# Altium schematic sheet TOP.SchDoc: Fast Stabilizer
size 420 x 297 mm; CheckedBy: G.Kasprowicz; Author: P. Zdunek; DrawnBy: P. Zdunek; Organization: Altium Limited; DocumentNumber: 1; SheetNumber: 1; SheetTotal: 37; Designer: P. Zdunek; ModifiedBy: -; CheckedDate: -; Title2: Title 2; DivGrp: WUT ISE
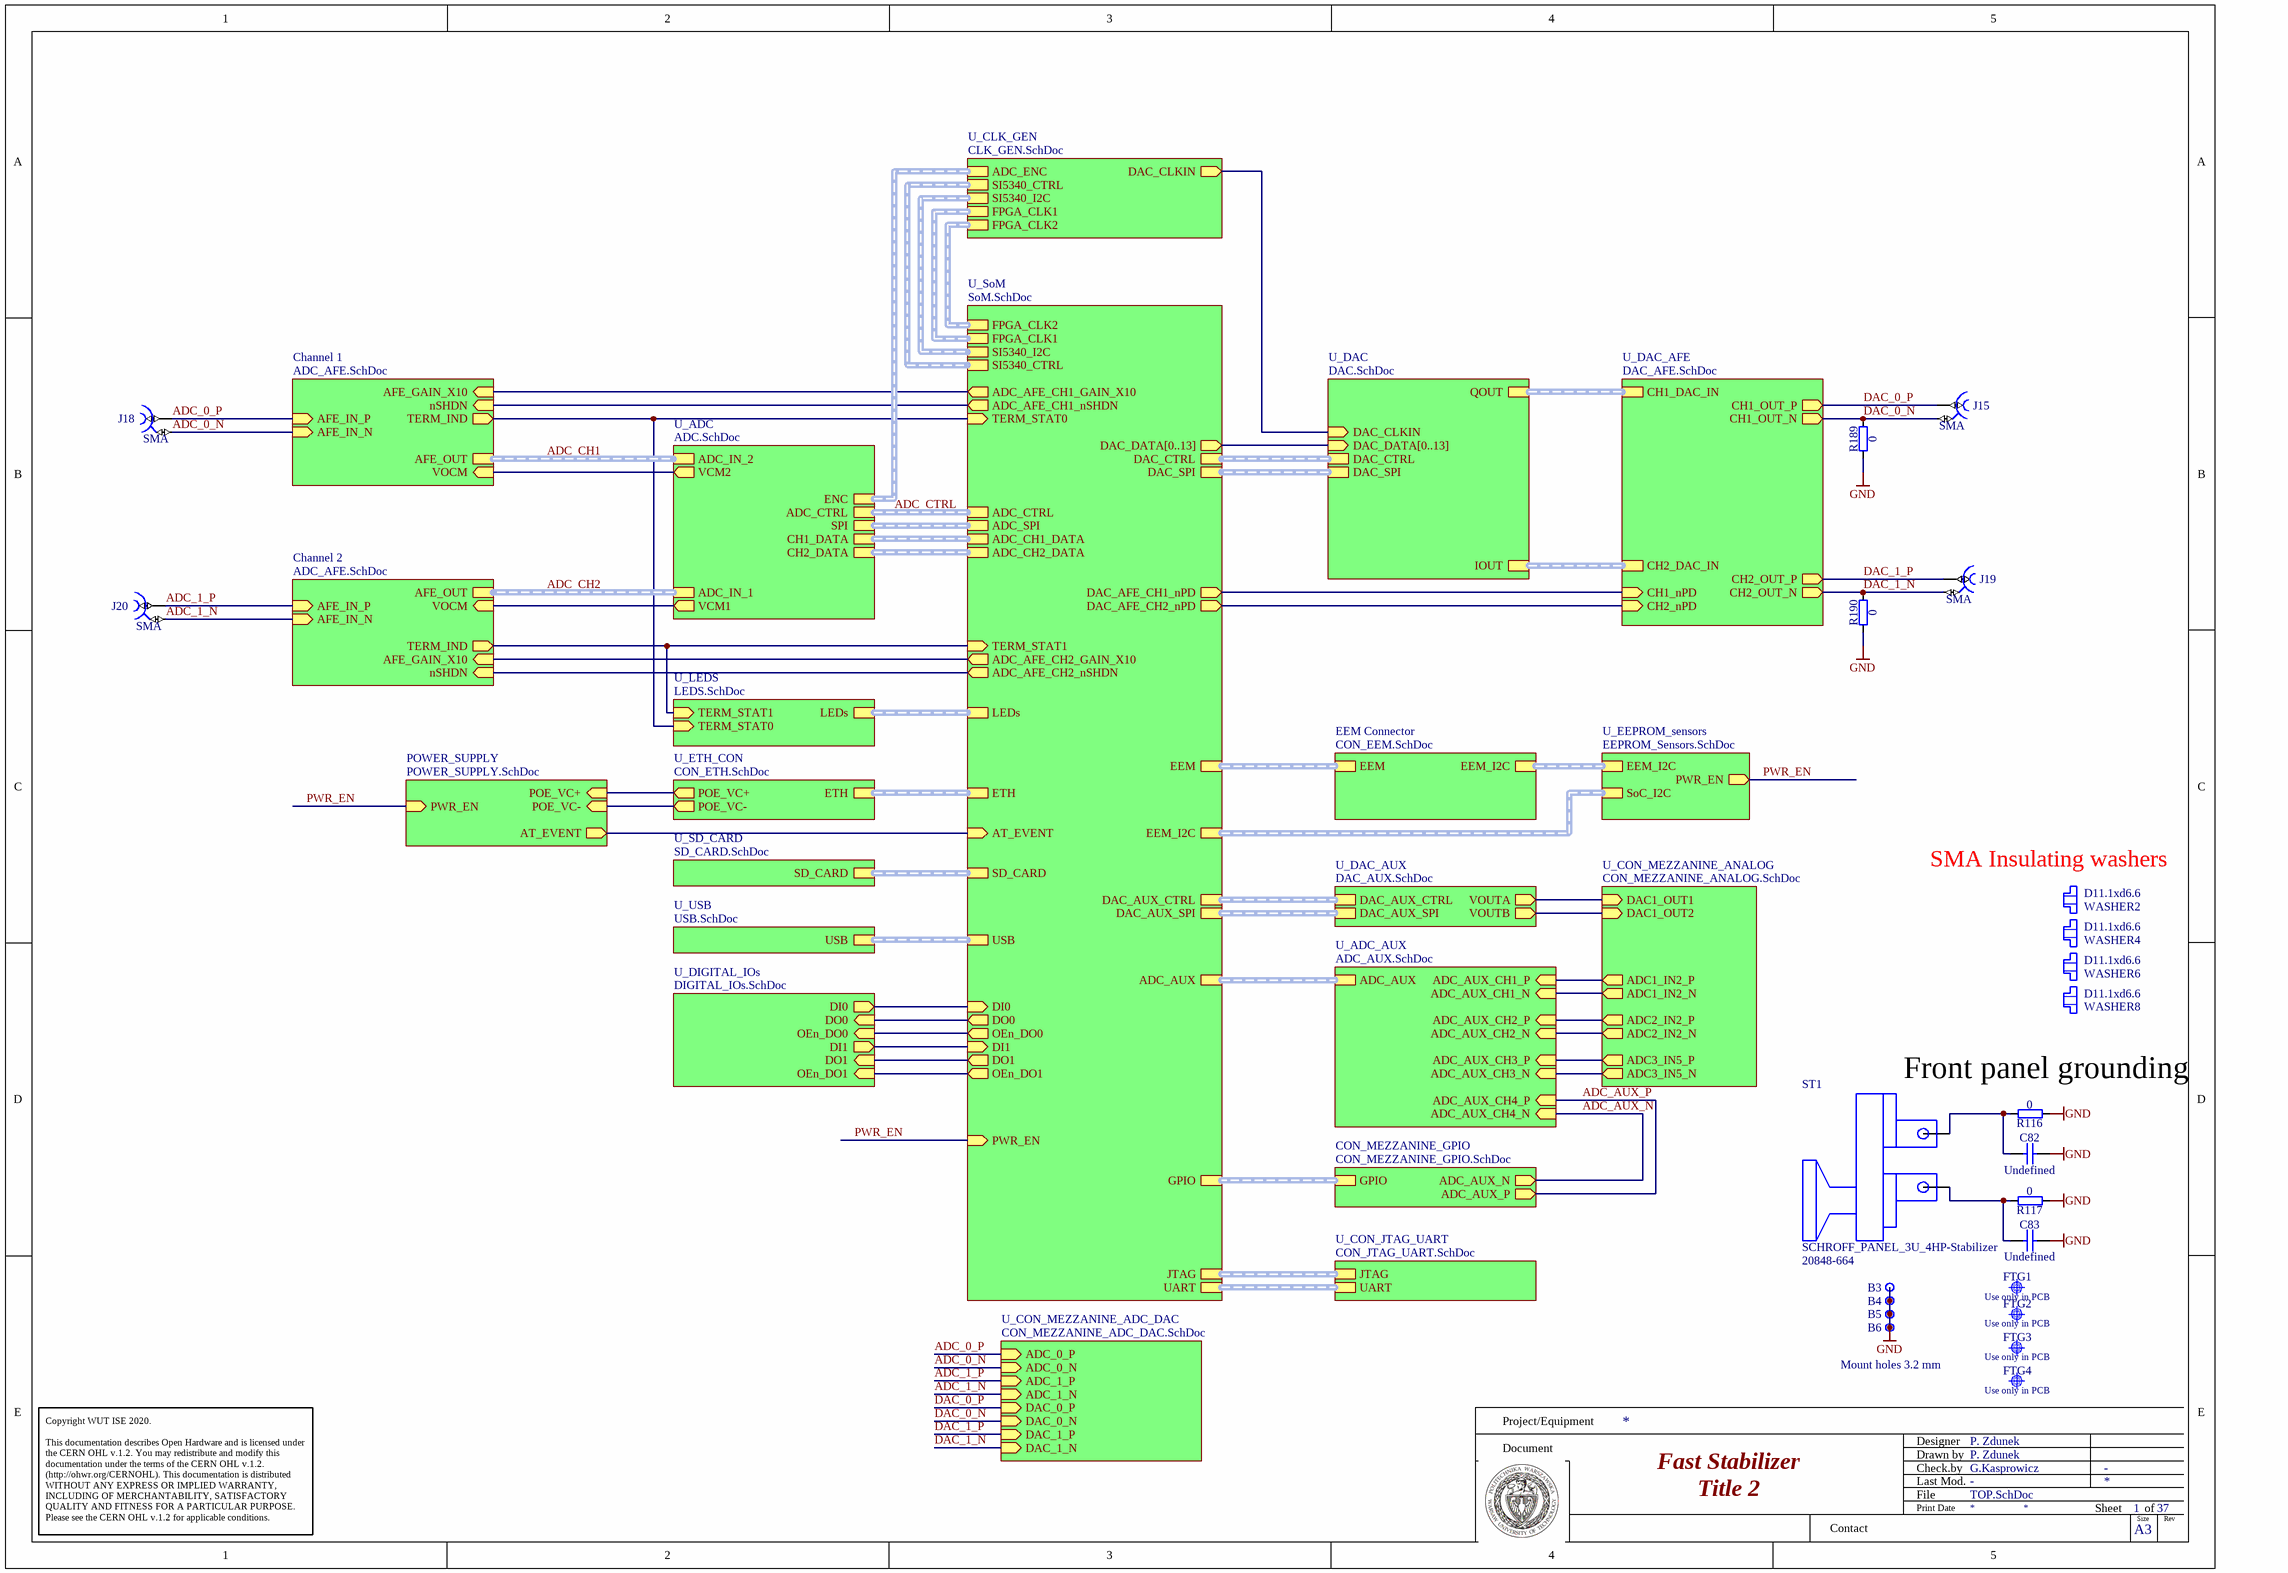
[diagram p0: TOP.SchDoc]

## Parts
B3  Plated Hole  [MTG320_550]  (value not drawn)  (no BOM)
B4  Plated Hole  [MTG320_550]  (value not drawn)  (no BOM)
B5  Plated Hole  [MTG320_550]  (value not drawn)  (no BOM)
B6  Plated Hole  [MTG320_550]  (value not drawn)  (no BOM)
C82  Undefined  [CAPC1608X90N]
C83  Undefined  [CAPC1608X90N]
FTG1  Use only in PCB  [FIDUCIAL_TOP_C100-200]  (no BOM)
FTG2  Use only in PCB  [FIDUCIAL_TOP_S100-200]  (no BOM)
FTG3  Use only in PCB  [FIDUCIAL_TOP_S100-200]  (no BOM)
FTG4  Use only in PCB  [FIDUCIAL_TOP_S100-200]  (no BOM)
J15  SMA  [DELOCK_65848]
J18  SMA  [DELOCK_65848]
J19  SMA  [DELOCK_65848]
J20  SMA  [DELOCK_65848]
R116  0  [RESC1005X40N]
R117  0  [RESC1005X40N]
R189  0  [RESC1005X40N]
R190  0  [RESC1005X40N]
ST1  SCHROFF_PANEL_3U_4HP-Stabilizer  Manufacturer Part Number 2: 20848-664  [SCHROFF_PANEL_3HP_4U - Stabilizer]
WASHER2  D11.1xd6.6  [Keystone_7687]
WASHER4  D11.1xd6.6  [Keystone_7687]
WASHER6  D11.1xd6.6  [Keystone_7687]
WASHER8  D11.1xd6.6  [Keystone_7687]

## Sub-sheets
Channel 1 = ADC_AFE.SchDoc: AFE_OUT (harness DIFF_SIGNAL), VOCM (in), AFE_IN_P (in), AFE_IN_N (in), nSHDN (in), AFE_GAIN_X10 (in), TERM_IND (out)
Channel 2 = ADC_AFE.SchDoc: AFE_OUT (harness DIFF_SIGNAL), VOCM (in), AFE_IN_P (in), AFE_IN_N (in), nSHDN (in), AFE_GAIN_X10 (in), TERM_IND (out)
CON_MEZZANINE_GPIO = CON_MEZZANINE_GPIO.SchDoc: GPIO (harness GPIO), ADC_AUX_P (out), ADC_AUX_N (out)
EEM Connector = CON_EEM.SchDoc: EEM (harness EEM), EEM_I2C (harness EEM_I2C)
POWER_SUPPLY = POWER_SUPPLY.SchDoc: POE_VC+ (in), POE_VC- (in), AT_EVENT (out), PWR_EN (in)
U_ADC = ADC.SchDoc: ADC_IN_1 (harness DIFF_SIGNAL), VCM1 (out), VCM2 (out), ADC_IN_2 (harness DIFF_SIGNAL), CH1_DATA (harness LTC2195_DATA), CH2_DATA (harness LTC2195_DATA), SPI (harness LTC2195_SPI), ENC (harness DIFFCLK), ADC_CTRL (harness LTC2195_CTRL)
U_ADC_AUX = ADC_AUX.SchDoc: ADC_AUX_CH3_P (in), ADC_AUX_CH3_N (in), ADC_AUX_CH2_P (in), ADC_AUX_CH2_N (in), ADC_AUX_CH1_P (in), ADC_AUX_CH1_N (in), ADC_AUX (harness ADC_AUX), ADC_AUX_CH4_N (in), ADC_AUX_CH4_P (in)
U_CLK_GEN = CLK_GEN.SchDoc: SI5340_CTRL (harness SI5340_CTRL), SI5340_I2C (harness I2C), FPGA_CLK1 (harness DIFFCLK), FPGA_CLK2 (harness DIFFCLK), DAC_CLKIN (out), ADC_ENC (harness DIFFCLK)
U_CON_JTAG_UART = CON_JTAG_UART.SchDoc: JTAG (harness JTAG), UART (harness UART)
U_CON_MEZZANINE_ADC_DAC = CON_MEZZANINE_ADC_DAC.SchDoc: ADC_0_P (in), ADC_0_N (in), ADC_1_P (in), ADC_1_N (in), DAC_0_P (in), DAC_0_N (in), DAC_1_P (in), DAC_1_N (in)
U_CON_MEZZANINE_ANALOG = CON_MEZZANINE_ANALOG.SchDoc: ADC1_IN2_P (out), ADC1_IN2_N (out), ADC2_IN2_N (out), ADC2_IN2_P (out), ADC3_IN5_P (out), ADC3_IN5_N (out), DAC1_OUT1 (in), DAC1_OUT2 (in)
U_DAC = DAC.SchDoc: QOUT (harness DIFF_SIGNAL), IOUT (harness DIFF_SIGNAL), DAC_DATA[0..13] (in), DAC_CTRL (harness AD9117_DAC_CTRL), DAC_SPI (harness AD9117_DAC_SPI), DAC_CLKIN (in)
U_DAC_AFE = DAC_AFE.SchDoc: CH1_nPD (in), CH1_OUT_P (out), CH1_DAC_IN (harness DIFF_SIGNAL), CH2_DAC_IN (harness DIFF_SIGNAL), CH2_OUT_P (out), CH2_nPD (in), CH1_OUT_N (out), CH2_OUT_N (out)
U_DAC_AUX = DAC_AUX.SchDoc: VOUTA (out), VOUTB (out), DAC_AUX_CTRL (harness DAC_AUX_CTRL), DAC_AUX_SPI (harness DAC_AUX_SPI)
U_DIGITAL_IOs = DIGITAL_IOs.SchDoc: DI1 (out), DI0 (out), OEn_DO0 (in), DO0 (in), OEn_DO1 (in), DO1 (in)
U_EEPROM_sensors = EEPROM_Sensors.SchDoc: EEM_I2C (harness EEM_I2C), SoC_I2C (harness EEM_I2C), PWR_EN (out)
U_ETH_CON = CON_ETH.SchDoc: ETH (harness ETH), POE_VC+ (out), POE_VC- (out)
U_LEDS = LEDS.SchDoc: LEDs (harness LEDs), TERM_STAT1 (in), TERM_STAT0 (in)
U_SD_CARD = SD_CARD.SchDoc: SD_CARD (harness SD_CARD)
U_SoM = SoM.SchDoc: EEM (harness EEM), EEM_I2C (harness EEM_I2C), TERM_STAT1 (in), ADC_AFE_CH2_GAIN_X10 (out), ADC_AFE_CH1_GAIN_X10 (out), TERM_STAT0 (in), LEDs (harness LEDs), ADC_AUX (harness ADC_AUX), DAC_AUX_CTRL (harness DAC_AUX_CTRL), DAC_AUX_SPI (harness DAC_AUX_SPI), DAC_DATA[0..13] (out), DAC_CTRL (harness AD9117_DAC_CTRL), DAC_AFE_CH1_nPD (out), FPGA_CLK2 (harness DIFFCLK), JTAG (harness JTAG), UART (harness UART), GPIO (harness GPIO), SI5340_CTRL (harness SI5340_CTRL), ADC_AFE_CH2_nSHDN (out), ADC_AFE_CH1_nSHDN (out), FPGA_CLK1 (harness DIFFCLK), SI5340_I2C (harness I2C), DAC_SPI (harness AD9117_DAC_SPI), ADC_CH2_DATA (harness LTC2195_DATA), ADC_CH1_DATA (harness LTC2195_DATA), ADC_SPI (harness LTC2195_SPI), ADC_CTRL (harness LTC2195_CTRL), DAC_AFE_CH2_nPD (out), ETH (harness ETH), SD_CARD (harness SD_CARD), USB (harness USB), DI0 (in), DI1 (in), AT_EVENT (in), DO0 (out), OEn_DO0 (out), DO1 (out), OEn_DO1 (out), PWR_EN (in)
U_USB = USB.SchDoc: USB (harness USB)

## Nets
GND: B3.1 B4.1 B5.1 B6.1 C82.2 C83.2 R116.1 R117.1 R189.1 R190.1
ADC_0_N: J18.2 ; sheet Channel 1/AFE_IN_N, sheet U_CON_MEZZANINE_ADC_DAC/ADC_0_N
ADC_0_P: J18.1 ; sheet Channel 1/AFE_IN_P, sheet U_CON_MEZZANINE_ADC_DAC/ADC_0_P
ADC_1_N: J20.2 ; sheet Channel 2/AFE_IN_N, sheet U_CON_MEZZANINE_ADC_DAC/ADC_1_N
ADC_1_P: J20.1 ; sheet Channel 2/AFE_IN_P, sheet U_CON_MEZZANINE_ADC_DAC/ADC_1_P
ADC_AUX_N: sheet CON_MEZZANINE_GPIO/ADC_AUX_N, sheet U_ADC_AUX/ADC_AUX_CH4_N
ADC_AUX_P: sheet CON_MEZZANINE_GPIO/ADC_AUX_P, sheet U_ADC_AUX/ADC_AUX_CH4_P
DAC_0_N: J15.2 R189.2 ; sheet U_DAC_AFE/CH1_OUT_N, sheet U_CON_MEZZANINE_ADC_DAC/DAC_0_N
DAC_0_P: J15.1 ; sheet U_DAC_AFE/CH1_OUT_P, sheet U_CON_MEZZANINE_ADC_DAC/DAC_0_P
DAC_1_N: J19.2 R190.2 ; sheet U_DAC_AFE/CH2_OUT_N, sheet U_CON_MEZZANINE_ADC_DAC/DAC_1_N
DAC_1_P: J19.1 ; sheet U_DAC_AFE/CH2_OUT_P, sheet U_CON_MEZZANINE_ADC_DAC/DAC_1_P
PWR_EN: sheet U_SoM/PWR_EN, sheet U_EEPROM_sensors/PWR_EN, sheet POWER_SUPPLY/PWR_EN
NetC82_1: C82.1 R116.2 ST1.1
NetC83_1: C83.1 R117.2 ST1.0
(unnamed): sheet U_SoM/TERM_STAT1, sheet U_LEDS/TERM_STAT1, sheet Channel 2/TERM_IND
(unnamed): sheet U_SoM/ADC_AFE_CH2_GAIN_X10, sheet Channel 2/AFE_GAIN_X10
(unnamed): sheet U_SoM/ADC_AFE_CH1_GAIN_X10, sheet Channel 1/AFE_GAIN_X10
(unnamed): sheet U_SoM/TERM_STAT0, sheet U_LEDS/TERM_STAT0, sheet Channel 1/TERM_IND
(unnamed): sheet U_SoM/DAC_AFE_CH1_nPD, sheet U_DAC_AFE/CH1_nPD
(unnamed): sheet U_SoM/ADC_AFE_CH2_nSHDN, sheet Channel 2/nSHDN
(unnamed): sheet U_SoM/ADC_AFE_CH1_nSHDN, sheet Channel 1/nSHDN
(unnamed): sheet U_SoM/DAC_AFE_CH2_nPD, sheet U_DAC_AFE/CH2_nPD
(unnamed): sheet U_SoM/DI0, sheet U_DIGITAL_IOs/DI0
(unnamed): sheet U_SoM/DI1, sheet U_DIGITAL_IOs/DI1
(unnamed): sheet U_SoM/AT_EVENT, sheet POWER_SUPPLY/AT_EVENT
(unnamed): sheet U_SoM/DO0, sheet U_DIGITAL_IOs/DO0
(unnamed): sheet U_SoM/OEn_DO0, sheet U_DIGITAL_IOs/OEn_DO0
(unnamed): sheet U_SoM/DO1, sheet U_DIGITAL_IOs/DO1
(unnamed): sheet U_SoM/OEn_DO1, sheet U_DIGITAL_IOs/OEn_DO1
(unnamed): sheet U_ADC/VCM1, sheet Channel 2/VOCM
(unnamed): sheet U_ADC/VCM2, sheet Channel 1/VOCM
(unnamed): sheet U_DAC/DAC_CLKIN, sheet U_CLK_GEN/DAC_CLKIN
(unnamed): sheet U_DAC_AUX/VOUTA, sheet U_CON_MEZZANINE_ANALOG/DAC1_OUT1
(unnamed): sheet U_DAC_AUX/VOUTB, sheet U_CON_MEZZANINE_ANALOG/DAC1_OUT2
(unnamed): sheet U_CON_MEZZANINE_ANALOG/ADC1_IN2_P, sheet U_ADC_AUX/ADC_AUX_CH1_P
(unnamed): sheet U_CON_MEZZANINE_ANALOG/ADC1_IN2_N, sheet U_ADC_AUX/ADC_AUX_CH1_N
(unnamed): sheet U_CON_MEZZANINE_ANALOG/ADC2_IN2_N, sheet U_ADC_AUX/ADC_AUX_CH2_N
(unnamed): sheet U_CON_MEZZANINE_ANALOG/ADC2_IN2_P, sheet U_ADC_AUX/ADC_AUX_CH2_P
(unnamed): sheet U_CON_MEZZANINE_ANALOG/ADC3_IN5_P, sheet U_ADC_AUX/ADC_AUX_CH3_P
(unnamed): sheet U_CON_MEZZANINE_ANALOG/ADC3_IN5_N, sheet U_ADC_AUX/ADC_AUX_CH3_N
(unnamed): sheet U_ETH_CON/POE_VC+, sheet POWER_SUPPLY/POE_VC+
(unnamed): sheet U_ETH_CON/POE_VC-, sheet POWER_SUPPLY/POE_VC-

## Buses and harness runs
bus sheet U_DAC/DAC_DATA[0..13] = sheet U_SoM/DAC_DATA[0..13]
harness ADC_CH1 = sheet Channel 1/AFE_OUT = sheet U_ADC/ADC_IN_2
harness ADC_CH2 = sheet Channel 2/AFE_OUT = sheet U_ADC/ADC_IN_1
harness ADC_CTRL = sheet U_ADC/ADC_CTRL = sheet U_SoM/ADC_CTRL
harness sheet CON_MEZZANINE_GPIO/GPIO = sheet U_SoM/GPIO
harness sheet EEM Connector/EEM = sheet U_SoM/EEM
harness sheet EEM Connector/EEM_I2C = sheet U_EEPROM_sensors/EEM_I2C
harness sheet U_ADC/CH1_DATA = sheet U_SoM/ADC_CH1_DATA
harness sheet U_ADC/CH2_DATA = sheet U_SoM/ADC_CH2_DATA
harness sheet U_ADC/ENC = sheet U_CLK_GEN/ADC_ENC
harness sheet U_ADC/SPI = sheet U_SoM/ADC_SPI
harness sheet U_ADC_AUX/ADC_AUX = sheet U_SoM/ADC_AUX
harness sheet U_CLK_GEN/FPGA_CLK1 = sheet U_SoM/FPGA_CLK1
harness sheet U_CLK_GEN/FPGA_CLK2 = sheet U_SoM/FPGA_CLK2
harness sheet U_CLK_GEN/SI5340_CTRL = sheet U_SoM/SI5340_CTRL
harness sheet U_CLK_GEN/SI5340_I2C = sheet U_SoM/SI5340_I2C
harness sheet U_CON_JTAG_UART/JTAG = sheet U_SoM/JTAG
harness sheet U_CON_JTAG_UART/UART = sheet U_SoM/UART
harness sheet U_DAC/DAC_CTRL = sheet U_SoM/DAC_CTRL
harness sheet U_DAC/DAC_SPI = sheet U_SoM/DAC_SPI
harness sheet U_DAC/IOUT = sheet U_DAC_AFE/CH2_DAC_IN
harness sheet U_DAC/QOUT = sheet U_DAC_AFE/CH1_DAC_IN
harness sheet U_DAC_AUX/DAC_AUX_CTRL = sheet U_SoM/DAC_AUX_CTRL
harness sheet U_DAC_AUX/DAC_AUX_SPI = sheet U_SoM/DAC_AUX_SPI
harness sheet U_EEPROM_sensors/SoC_I2C = sheet U_SoM/EEM_I2C
harness sheet U_ETH_CON/ETH = sheet U_SoM/ETH
harness sheet U_LEDS/LEDs = sheet U_SoM/LEDs
harness sheet U_SD_CARD/SD_CARD = sheet U_SoM/SD_CARD
harness sheet U_SoM/USB = sheet U_USB/USB

## Notes on the sheet
- (near WASHER2) SMA Insulating washers
- (near R116) Front panel grounding
- Mount holes 3.2 mm
- Project/Equipment
- Document
- Designer
- Drawn by
- Check.by
- Copyright WUT ISE 2020.
  This documentation describes Open Hardware and is licensed under the CERN OHL v.1.2. You may redistribute and modify this documentation under the terms of the CERN OHL v.1.2. (http://ohwr.org/CERNOHL). This documentation is distributed WITHOUT ANY EXPRESS OR IMPLIED WARRANTY, INCLUDING OF MERCHANTABILITY, SATISFACTORY QUALITY AND FITNESS FOR A PARTICULAR PURPOSE. Please see the CERN OHL v.1.2 for applicable conditions.
- Contact
- File
- Last Mod.
- Print Date
- Sheet
- Size
- A3
- of
- Rev

## Library data of the parts
B3-B6 = PLATED_HOLE3.2_PAD5.5: Single Terminal Socket; Part Description: Plated Through Hole: Hole Dia.=3.2mm Pad Dia.=5.5mm; Mounted: No; Part Number: PLATED_HOLE3.2_PAD5.5; Component Type: Standard (No BOM); Pin Count: 1; Family: Plated Hole; Socket: No; SMD: No; Sense: No; Status: None; ComponentHeight: 0mm; HelpURL: Undefined; Author: CERN DEM JMW; CreateDate: 01/10/2012; LatestRevisionDate: 01/10/2012; PackageDescription: Plated Through Hole: Hole Dia.=3.2mm Pad Dia.=5.5mm
C82 C83 = CC0603_NO-VALUE: Non-polarised capacitor; Part Description: Reserved Footprint For 0603(1608) Chip Ceramic Capacitor; Mounted: No; Part Number: CC0603_NO-VALUE; Component Kind: Standard; Component Type: Standard; Pin Count: 2; Value: Undefined; Status: None; Manufacturer: Undefined; Manufacturer Part Number: CC0603_NO-VALUE; Case: 0603; Socket: No; SMD: Yes; Sense: No; Manufacturer1 ComponentHeight: 0.9mm; HelpURL: Undefined; Author: CERN DEM MR; CreateDate: 22.11.2016; LatestRevisionDate: 22.11.2016
FTG1 = FIDUCIAL_TARGET_C100-200: Fiducial Target; Part Description: Round Fiducial Target, Top Layer, 1.0mm, Top Solder 2.0mm, Keepout =2.0mm; Mounted: No; Part Number: FIDUCIAL_TARGET_C100-200; Component Type: Standard (No BOM); Pin Count: 1; Family: Fiducial; Socket: No; SMD: Yes; Sense: No; Status: None; ComponentHeight: 0mm; HelpURL: Undefined; Author: CERN DEM JLC; CreateDate: 09.02.2010; LatestRevisionDate: 04.04.2012; PackageDescription: Round Fiducial Target, Top Layer, 1.0mm, Top Solder 2.0mm, Keepout =2.0mm
FTG2-FTG4 = FIDUCIAL_TARGET_S100-200: Fiducial Target; Part Description: Square Fiducial Target, Top Layer, 1.0mm, Top Solder 2.0mm, Keepout =2.0mm; Mounted: No; Part Number: FIDUCIAL_TARGET_S100-200; Component Type: Standard (No BOM); Pin Count: 1; Family: Fiducial; Socket: No; SMD: Yes; Sense: No; Status: None; ComponentHeight: 0mm; HelpURL: Undefined; Author: CERN DEM JLC; CreateDate: 09.02.2010; LatestRevisionDate: 04.04.2012; PackageDescription: Square Fiducial Target, Top Layer, 1.0mm, Top Solder 2.0mm, Keepout =2.0mm
J15 J18-J20 = CON_SMA_DELOCK_65848: 50 Ohm Through Hole SMA Right Angle PCB Jack; Manufacturer: DELOCK; Manufacturer Part Number: 5848 (4043619658480); PressFit: No; Part Number: DELOCK_65848; Component Kind: Standard; Component Type: Standard; Pin Count: 5; Family: SMA; Mounted: Yes; Socket: No; SMD: No; Sense: No; Status: None; Part Description: 50 Ohm Through Hole SMA Right Angle PCB Jack; ComponentHeight: 12.5; HelpURL: \\cern.ch\dfs\Applications\Altium\Datasheets\AMPHENOL_132203-16.pdf; Author: GK; CreateDate: 13.05.2019; LatestRevisionDate: 13.05.2019
R116 R117 R189 R190 = R0402_0R_JUMPER: Resistor; Part Description: 1A (0.05R Max DC Resistance) Zero Ohm Jumper; Manufacturer: GENERIC; Manufacturer1 Part Number: 232270591001L; PressFit: No; Part Number: R0402_0R_JUMPER; Component Kind: Standard; Component Type: Standard; Pin Count: 2; Value: 0; Status: Not Recommended; Manufacturer Part Number: R0402_0R_JUMPER; Case: 0402; Mounted: Yes; Sense: No; Socket: No; SMD: Yes; Manufacturer1 Example: YAGEO PHYCOMP; Manufacturer1 ComponentHeight: 0.4mm; HelpURL: \\cern.ch\dfs\Applications\Altium\Datasheets\R0402_Phycomp_RC0402.pdf; Author: CERN DEM JLC; CreateDate: 03/12/2007; LatestRevisionDate: 17/10/2012
ST1 = SCHROFF_PANEL_3U_4HP_Stabilizer: Schroff 3HP 4U EUROCARD Panel; Manufacturer Part Number: 20818-017; Manufacturer: Schroff
WASHER2 WASHER4 WASHER6 WASHER8 = Keystone_7687: SMA_Shoulder Washer; Part Number: Custom 3D printed; Part Description: Polyphenylene Sulfide PPS Shoulder Washer; PressFit: No; Component Kind: Standard; Component Type: Mechanical; Footprint: Custom 3D printed; Pin Count: 0; PackageDescription: Polyphenylene Sulfide PPS Shoulder Washer; Mounted: Yes; Socket: No; SMD: No; Sense: No; Status: None; Value: D11.1xd6.6; Manufacturer: Custom 3D printed; Manufacturer Part Number: Custom 3D printed; ComponentHeight: 1.91mm; HelpURL: \\cern.ch\dfs\Applications\Altium\Datasheets\AAVID-THERMALLOY_7721-7PPSG.pdf; Author: GK; CreateDate: 28.01.2016; LatestRevisionDate: 28.01.2016